# EAGLE design teiler10e7V3 (EAGLE 7.7.0)
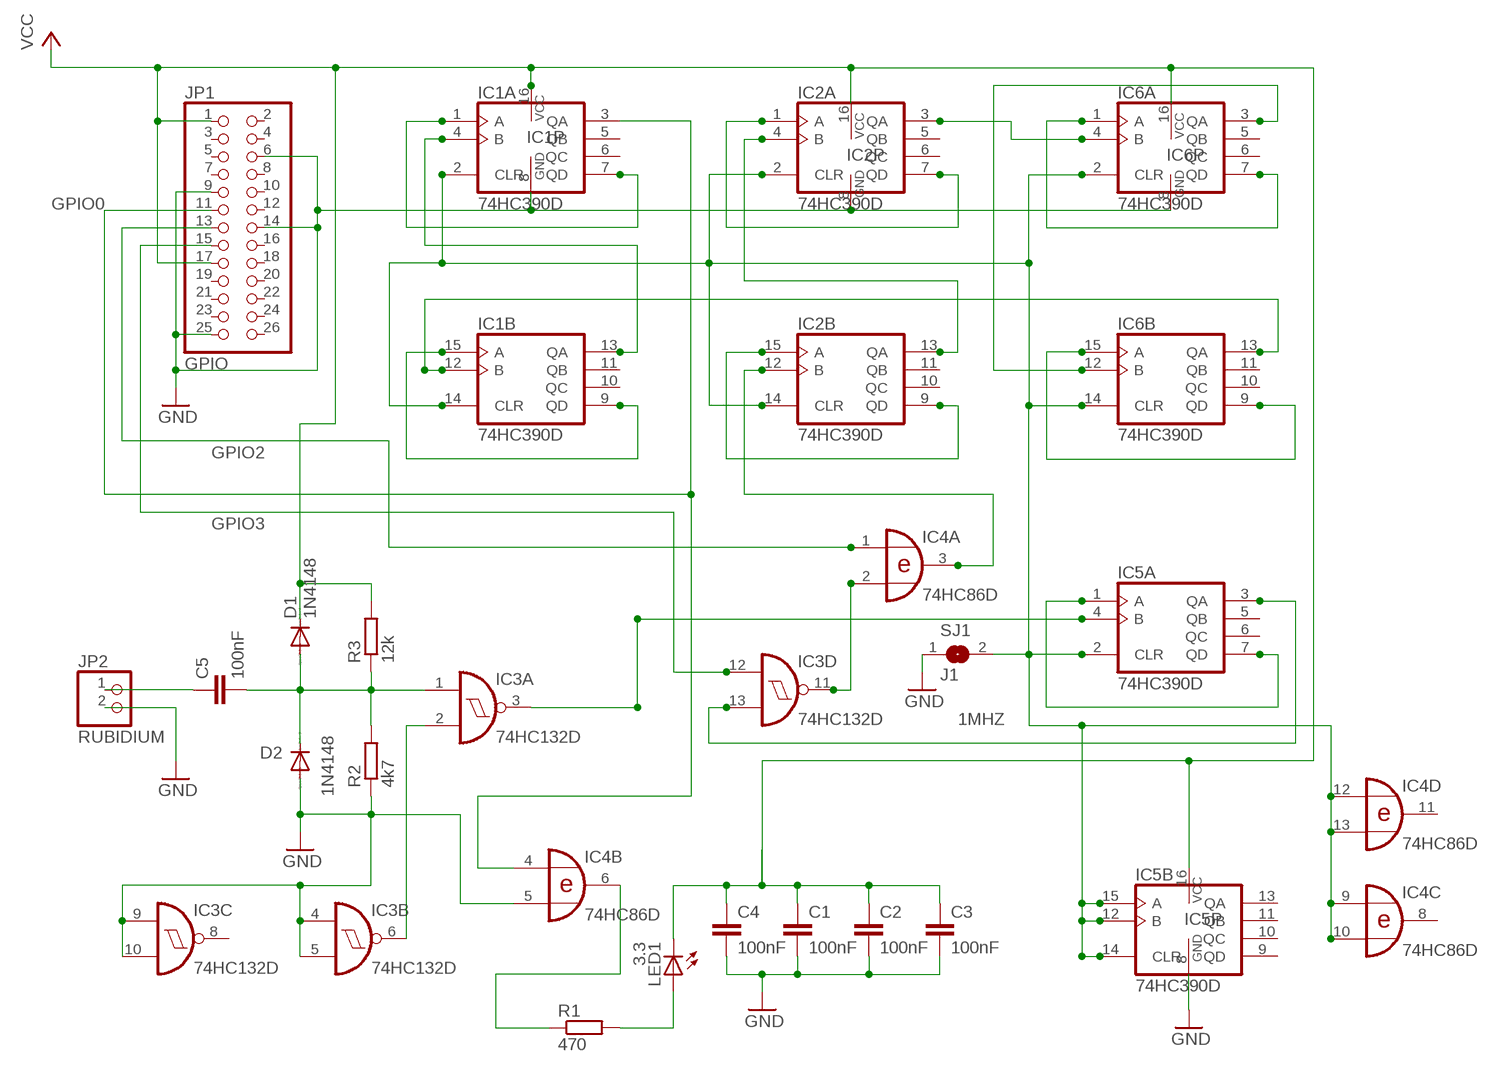
[diagram p0: schematic, sheet 1]

## Parts
C1  100nF  C-EU025-025X050  [C025-025X050]
C2  100nF  C-EU025-025X050  [C025-025X050]
C3  100nF  C-EU025-025X050  [C025-025X050]
C4  100nF  C-EU025-025X050  [C025-025X050]
C5  100nF  C-EU025-025X050  [C025-025X050]
D1  1N4148  1N4148DO35-7  [DO35-7]
D2  1N4148  1N4148DO35-7  [DO35-7]
IC1  74HC390D  [SO16]
IC2  74HC390D  [SO16]
IC3  74HC132D  [SO14]
IC4  74HC86D  [SO14]
IC5  74HC390D  [SO16]
IC6  74HC390D  [SO16]
JP1  GPIO  PINHD-2X13  [2X13]
JP2  RUBIDIUM  PINHD-1X2/90  [1X02/90]
LED1  3.3  LED3MM  [LED3MM]
R1  470  R-EU_0207/10  [0207/10]
R2  4k7  R-EU_0207/10  [0207/10]
R3  12k  R-EU_0207/10  [0207/10]
SJ1  J1  SJW  [SJW]

## Nets
1KHZ: IC6.3(A:QA) IC6.12(B:B)
1MHZ: IC3.13(D:I1) IC5.3(A:QA)
10KHZ: IC2.3(A:QA) IC6.4(A:B)
100KHZ: IC2.4(A:B) IC2.13(B:QA)
CLR: IC1.2(A:CLR) IC1.14(B:CLR) IC2.2(A:CLR) IC2.14(B:CLR) IC4.9(C:I0) IC4.10(C:I1) IC4.12(D:I0) IC4.13(D:I1) IC5.2(A:CLR) IC5.12(B:B) IC5.14(B:CLR) IC5.15(B:A) IC6.2(A:CLR) IC6.14(B:CLR) SJ1.2
GND: C1.2 C2.2 C3.2 C4.2 D2.A IC1.8(P:GND) IC2.8(P:GND) IC3.4(B:I0) IC3.5(B:I1) IC3.9(C:I0) IC3.10(C:I1) IC4.5(B:I1) IC5.8(P:GND) IC6.8(P:GND) JP1.6 JP1.9 JP1.14 JP1.25 JP2.2 R2.1 SJ1.1
GPIO0: IC1.3(A:QA) IC4.4(B:I0) JP1.11
GPIO2: IC4.1(A:I0) JP1.13
GPIO3: IC3.12(D:I0) JP1.15
N$1: IC1.1(A:A) IC1.7(A:QD)
N$2: IC2.1(A:A) IC2.7(A:QD)
N$3: IC1.9(B:QD) IC1.15(B:A)
N$4: IC2.9(B:QD) IC2.15(B:A)
N$5: IC5.1(A:A) IC5.7(A:QD)
N$6: IC1.12(B:B) IC6.13(B:QA)
N$7: IC2.12(B:B) IC4.3(A:O)
N$9: IC1.4(A:B) IC1.13(B:QA)
N$11: C5.1 JP2.1
N$12: IC4.6(B:O) R1.1
N$13: IC3.11(D:O) IC4.2(A:I1)
N$14: IC6.1(A:A) IC6.7(A:QD)
N$15: IC6.9(B:QD) IC6.15(B:A)
N$17: IC3.2(A:I1) IC3.6(B:O)
N$19: IC3.3(A:O) IC5.4(A:B)
N$21: LED1.A R1.2
RUBIDIUM: C5.2 D1.A D2.C IC3.1(A:I0) R2.2 R3.1
VCC: C1.1 C2.1 C3.1 C4.1 D1.C IC1.16(P:VCC) IC2.16(P:VCC) IC5.16(P:VCC) IC6.16(P:VCC) JP1.1 JP1.17 LED1.K(C) R3.2
Unconnected: IC1.5(A:QB) IC1.6(A:QC) IC1.10(B:QC) IC1.11(B:QB) IC2.5(A:QB) IC2.6(A:QC) IC2.10(B:QC) IC2.11(B:QB) IC3.8(C:O) IC4.8(C:O) IC4.11(D:O) IC5.5(A:QB) IC5.6(A:QC) IC5.9(B:QD) IC5.10(B:QC) IC5.11(B:QB) IC5.13(B:QA) IC6.5(A:QB) IC6.6(A:QC) IC6.10(B:QC) IC6.11(B:QB) JP1.2 JP1.3 JP1.4 JP1.5 JP1.7 JP1.8 JP1.10 JP1.12 JP1.16 JP1.18 JP1.19 JP1.20 JP1.21 JP1.22 JP1.23 JP1.24 JP1.26

## Power pins joined to a net without a drawn wire
GND: IC3.7(P:GND) IC4.7(P:GND)
VCC: IC3.14(P:VCC) IC4.14(P:VCC)

## Library data of the parts
C1-C5 = rcl:C-EU: CAPACITOR, European symbol
D1 D2 = diode:1N4148: DIODE high speed (Philips)
IC1 IC2 IC5 IC6 = 74xx-eu:74*390: Dual 4-bit decade and binary COUNTER
IC3 = 74xx-eu:74*132: Quad 2-input NAND schmitt trigger
IC4 = 74xx-eu:74*86: Quad 2-input EXCLUSIVE-OR (XOR) gate
JP1 = pinhead:PINHD-2X13: PIN HEADER
JP2 = pinhead:PINHD-1X2: PIN HEADER
LED1 = led:LED: LED OSRAM: - CHIPLED LG R971, LG N971, LY N971, LG Q971, LY Q971, LO R971, LY R971 LH N974, LH R974 LS Q976, LO Q976, LY Q976 LO Q996 - Hyper CHIPLED LW Q18S LB Q993, LB Q99A, LB R99A - SideLED LS A670, LO A670, LY A670, LG A670, LP A670 LB A673, LV A673, LT A673, LW A673 LH A674 LY A675 LS A676, LA A676, LO A676, LY A676, LW A676 LS A679, LY A679, LG A679 - Hyper Micro SIDELED® LS Y876, LA Y876, LO Y876, LY Y876 LT Y87S - SmartLED LW L88C, LW L88S LB L89C, LB L89S, LG L890 LS L89K, LO L89K, LY L89K LS L896, LA L896, LO L896, LY L896 - TOPLED LS T670, LO T670, LY T670, LG T670, LP T670 LSG T670, LSP T670, LSY T670, LOP T670, LYG T670 LG T671, LOG T671, LSG T671 LB T673, LV T673, LT T673, LW T673 LH T674 LS T676, LA T676, LO T676, LY T676, LB T676, LH T676, LSB T676, LW T676 LB T67C, LV T67C, LT T67C, LS T67K, LO T67K, LY T67K, LW E67C LS E67B, LA E67B, LO E67B, LY E67B, LB E67C, LV E67C, LT E67C LW T67C LS T679, LY T679, LG T679 LS T770, LO T770, LY T770, LG T770, LP T770 LB T773, LV T773, LT T773, LW T773 LH T774 LS E675, LA E675, LY E675, LS T675 LS T776, LA T776, LO T776, LY T776, LB T776 LHGB T686 LT T68C, LB T68C - Hyper Mini TOPLED® LB M676 - Mini TOPLED Santana® LG M470 LS M47K, LO M47K, LY M47K Source: http://www.osram.convergy.de LUXEON: - LUMILED® LXK2-PW12-R00, LXK2-PW12-S00, LXK2-PW14-U00, LXK2-PW14-V00 LXK2-PM12-R00, LXK2-PM12-S00, LXK2-PM14-U00 LXK2-PE12-Q00, LXK2-PE12-R00, LXK2-PE12-S00, LXK2-PE14-T00, LXK2-PE14-U00 LXK2-PB12-K00, LXK2-PB12-L00, LXK2-PB12-M00, LXK2-PB14-N00, LXK2-PB14-P00, LXK2-PB14-Q00 LXK2-PR12-L00, LXK2-PR12-M00, LXK2-PR14-Q00, LXK2-PR14-R00 LXK2-PD12-Q00, LXK2-PD12-R00, LXK2-PD12-S00 LXK2-PH12-R00, LXK2-PH12-S00 LXK2-PL12-P00, LXK2-PL12-Q00, LXK2-PL12-R00 Source: www.luxeon.com KINGBRIGHT: KA-3528ASYC Source: www.kingbright.com
R1-R3 = rcl:R-EU_: RESISTOR, European symbol
SJ1 = jumper:SJ: SMD solder JUMPER

## Net classes
0 default: clearance 0.205 mm

## Board
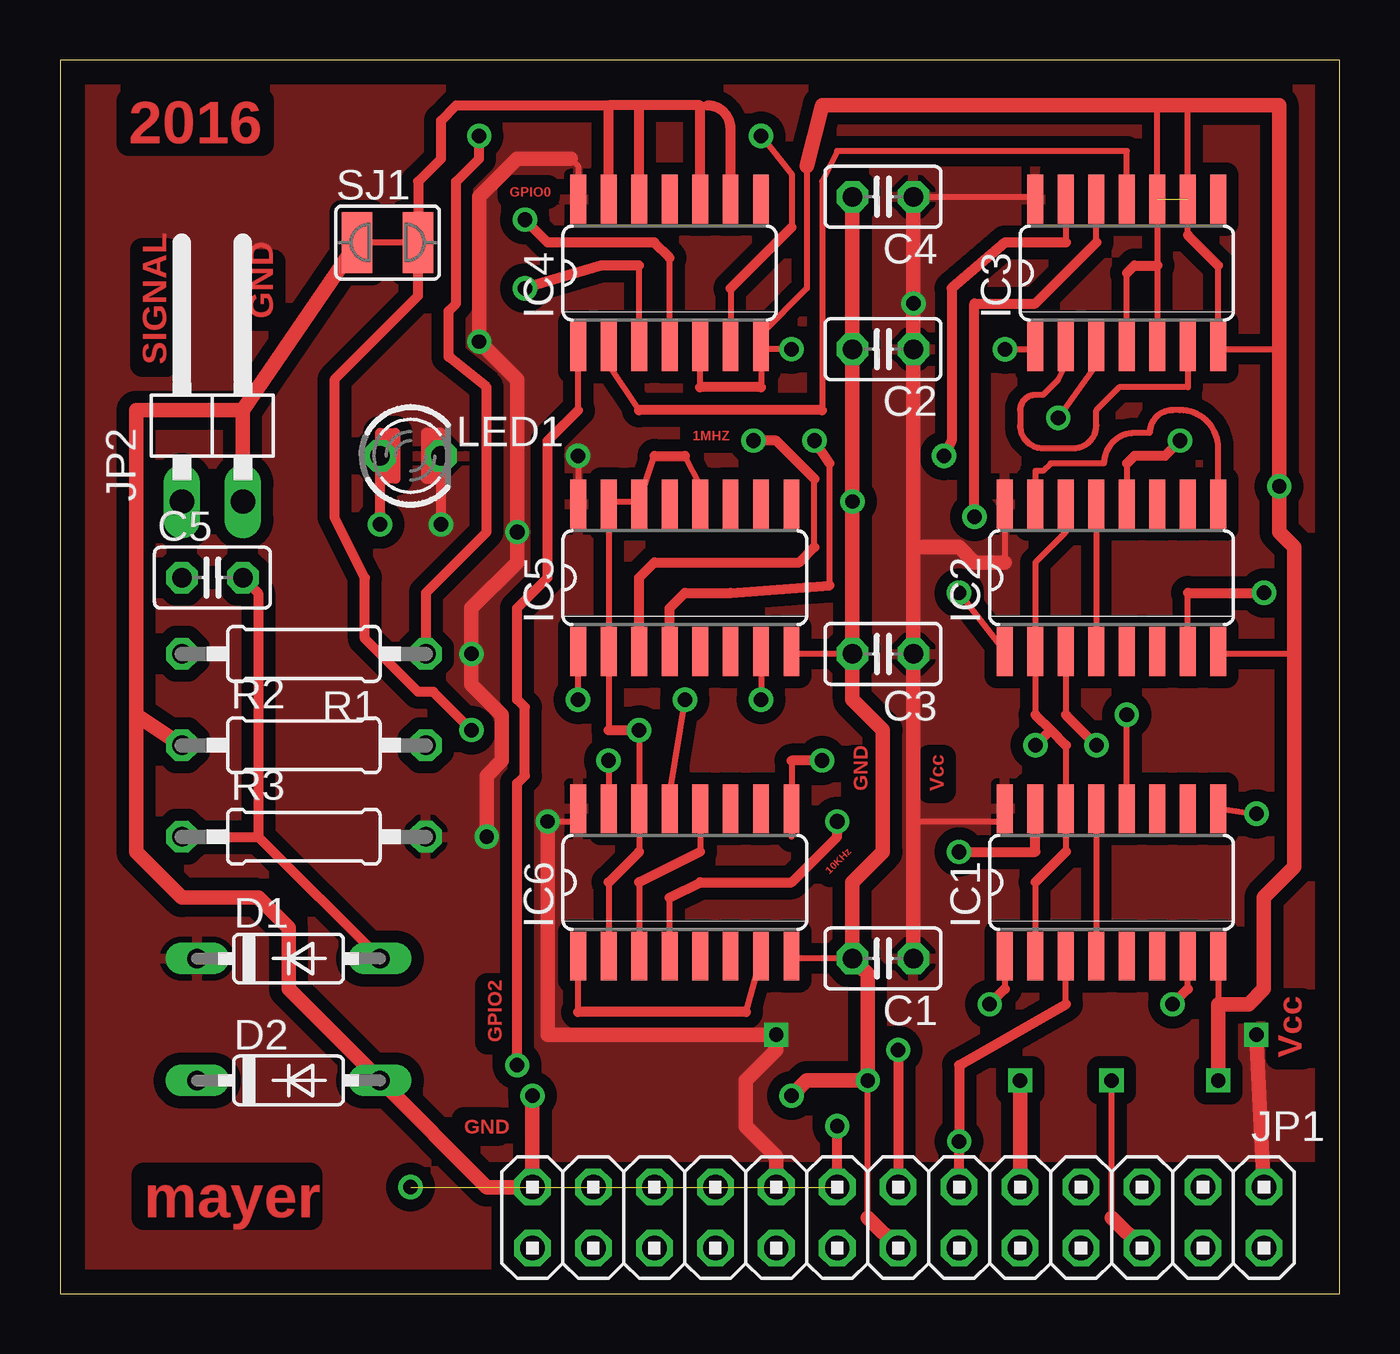
[diagram p1: board, top side]
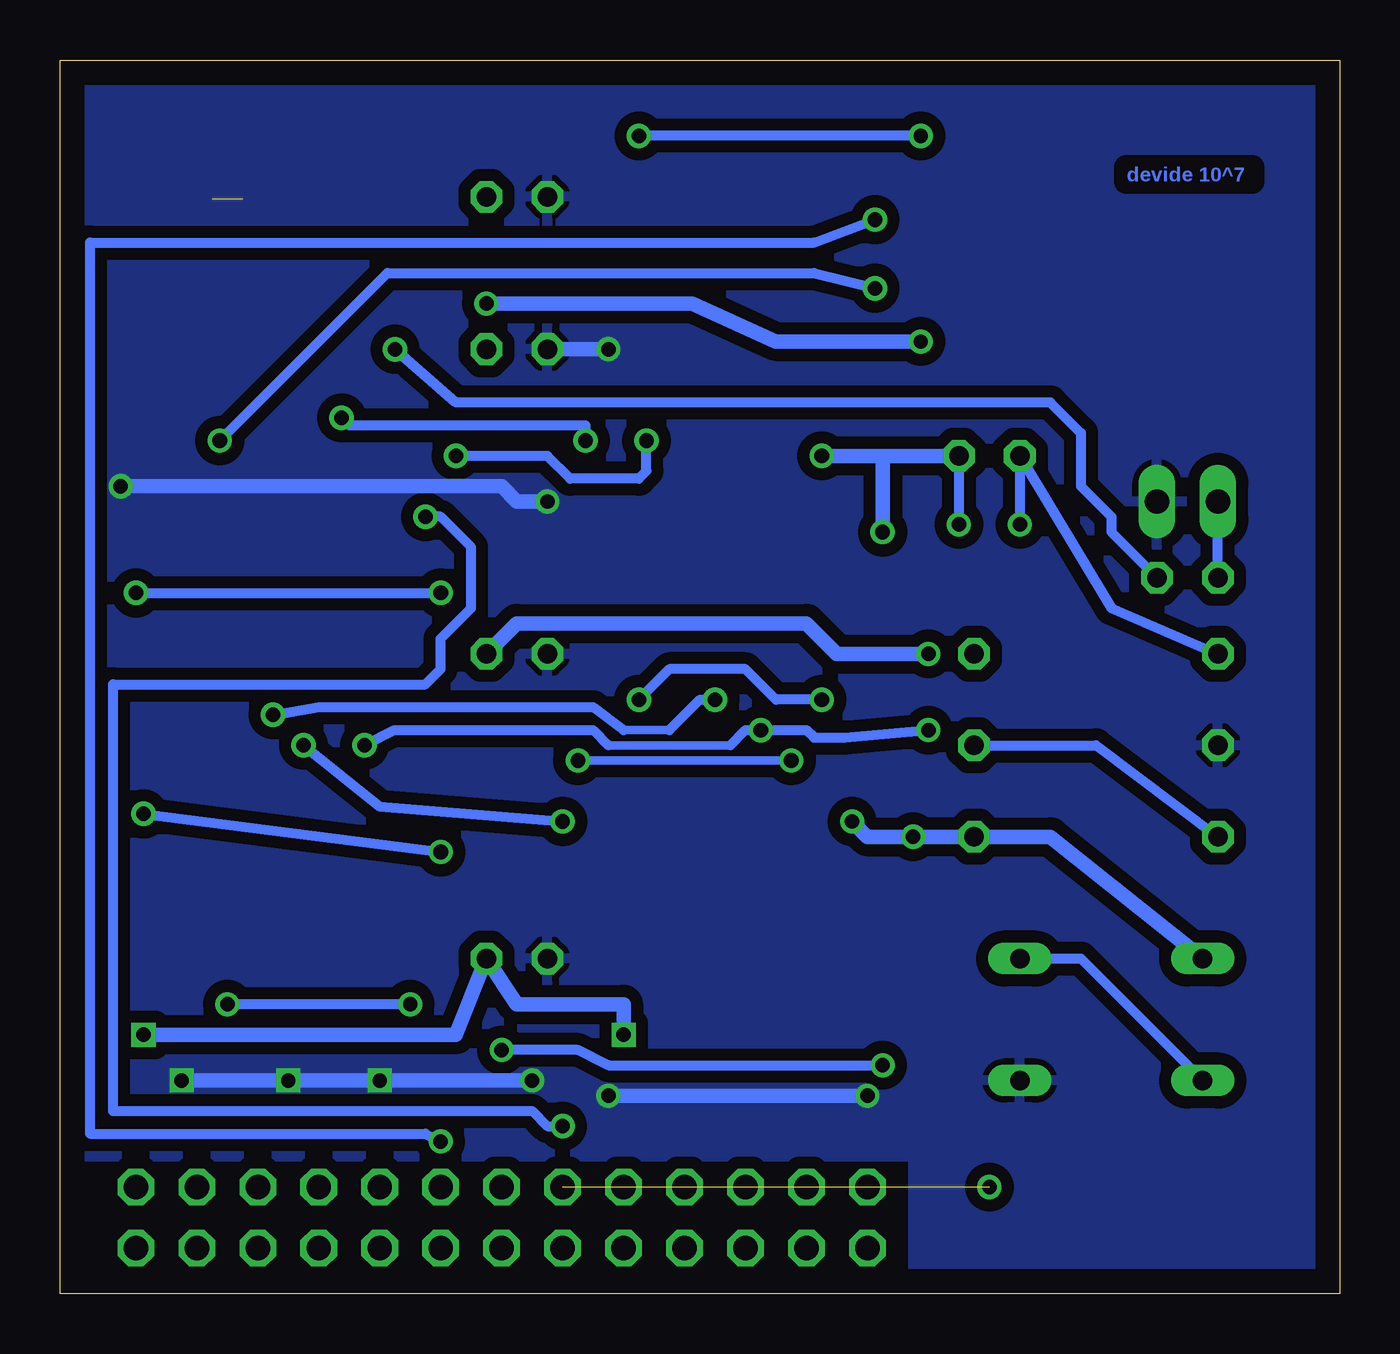
[diagram p2: board, bottom side, seen from below]

Size 53.33 x 51.43 mm. Coordinates in mm from the lower left corner, seen from the top.
Outline: 0,0 53.33,0 53.33,51.43 0,51.43 0,0
Copper layers (1*16): Top 0.035mm / dielectric 1.5mm / Bottom 0.035mm
Design rules "my_drc_defaults *": minimum track width 10mil, minimum drill 0.599440625mm, track to track 10mil, track to pad 10mil, pad to pad 10mil, via to via 10mil, smd to smd 10mil, copper to edge 40mil, drill to drill 8mil, minimum pad ring 10mil, minimum via ring 8mil, stop-mask expansion 4mil, vias tented up to drill 0mil, thermal gap 10mil

### Footprints (pad centres in the part's own frame; a part is rotated, then mirrored left to right if it is on the bottom)
C025-025X050 = drill 0.813 octagon: 1 -1.27,0; 2 1.27,0
DO35-7 = drill 0.813 long: A 3.81,0; C -3.81,0
SO16 = smd 0.66 x 2.032: 1 -4.445,-3.073; 2 -3.175,-3.073; 3 -1.905,-3.073; 4 -0.635,-3.073; 5 0.635,-3.073; 6 1.905,-3.073; 7 3.175,-3.073; 8 4.445,-3.073; 9 4.445,3.073; 10 3.175,3.073; 11 1.905,3.073; 12 0.635,3.073; 13 -0.635,3.073; 14 -1.905,3.073; 15 -3.175,3.073; 16 -4.445,3.073
SO14 = smd 0.66 x 2.032: 1 -3.81,-3.073; 2 -2.54,-3.073; 3 -1.27,-3.073; 4 0,-3.073; 5 1.27,-3.073; 6 2.54,-3.073; 7 3.81,-3.073; 8 3.81,3.073; 9 2.54,3.073; 10 1.27,3.073; 11 0,3.073; 12 -1.27,3.073; 13 -2.54,3.073; 14 -3.81,3.073
2X13 = drill 1.016 octagon: 1 -15.24,-1.27; 2 -15.24,1.27; 3 -12.7,-1.27; 4 -12.7,1.27; 5 -10.16,-1.27; 6 -10.16,1.27; 7 -7.62,-1.27; 8 -7.62,1.27; 9 -5.08,-1.27; 10 -5.08,1.27; 11 -2.54,-1.27; 12 -2.54,1.27; 13 0,-1.27; 14 0,1.27; 15 2.54,-1.27; 16 2.54,1.27; 17 5.08,-1.27; 18 5.08,1.27; 19 7.62,-1.27; 20 7.62,1.27; 21 10.16,-1.27; 22 10.16,1.27; 23 12.7,-1.27; 24 12.7,1.27; 25 15.24,-1.27; 26 15.24,1.27
1X02/90 = drill 1.016 long: 1 -1.27,-3.81; 2 1.27,-3.81
LED3MM = drill 0.813 octagon: A -1.27,0; K 1.27,0
0207/10 = drill 0.813 octagon: 1 -5.08,0; 2 5.08,0
SJW = smd 1.27 x 2.54: 1 -1.27,0; 2 1.27,0

### Placement (x,y rotation side)
C1  34.29,13.97 180 top
C2  34.29,39.37 180 top
C3  34.29,26.67 180 top
C4  34.29,45.72 180 top
C5  6.35,29.84 0 top
D1  9.52,13.97 0 top
D2  9.52,8.89 0 top
IC1  43.81,17.14 0 top
IC2  43.81,29.84 0 top
IC3  44.45,42.55 0 top
IC4  25.4,42.55 0 top
IC5  26.03,29.84 0 top
IC6  26.03,17.14 0 top
JP1  34.92,3.17 180 top
JP2  6.35,36.83 0 top
LED1  14.61,34.93 0 top
R1  10.16,26.67 180 top
R2  10.16,22.86 0 top
R3  10.16,19.05 0 top
SJ1  13.65,43.82 0 top

### Tracks (layer width: path | path; a pad name or v marks a point on that pad's centre or on a via)
1KHZ
  Top 0.254: 24.13,17.14 IC6.3 | IC6.12 26.67,18.41
  Top 0.406: 26.67,18.41 24.13,17.14
1MHZ  (via drill 0.61)
  Top 0.254: IC3.13 41.91,43.82 | 31.43,31.11 31.43,33.97
  Top 0.406: v36.83,34.93 37.15,35.56 37.15,41.91 39.37,43.82 41.91,43.82 | IC5.3 24.13,29.84 24.77,30.48 30.8,30.48 31.43,31.11 | 31.43,33.97 29.84,35.56 v28.89,35.56
  Bottom 0.406: v28.89,35.56 28.89,34.29 29.21,33.97 32.07,33.97 33.02,34.93 v36.83,34.93
10KHZ  (via drill 0.61)
  Top 0.254: IC2.3 41.91,24.13 | IC6.4 25.4,16.51
  Top 0.406: 41.91,24.13 v43.18,22.86 | 25.4,16.51 26.67,17.14 30.48,17.14 32.38,19.05 v32.38,19.68
  Bottom 0.406: v43.18,22.86 40.01,20.32 v32.38,19.68
100KHZ
  Top 0.254: IC2.13 IC2.4
CLR  (via drill 0.6, 0.61)
  Top 0.254: 40.64,17.14 IC1.2 | 41.91,18.41 IC1.14 41.91,22.86 | IC2.14 41.91,31.75 40.64,30.48 IC2.2 40.64,24.13 | 22.86,17.14 IC6.2 | 24.13,18.41 IC6.14 v24.13,23.49 | 22.86,45.72 IC4.13 | 24.13,33.02 22.86,33.02 IC5.15 IC5.2 22.86,23.49 | IC5.12 26.67,33.66 26.03,34.93 | 24.13,33.02 24.77,34.93 | 24.13,33.02 IC5.14 | 26.99,49.53 26.67,49.53
  Top 0.406: 41.91,18.41 40.64,17.14 | 40.64,24.13 41.27,23.49 | 41.27,23.49 41.91,22.86 | 24.13,18.41 22.86,17.14 | 24.77,34.93 26.03,34.93 | 22.86,23.49 v24.13,23.49 | v40.64,22.86 41.27,23.49 | IC4.13 22.86,49.53 | IC4.10 26.67,49.53 24.13,49.53 | 24.13,49.53 22.86,49.53 | IC4.12 24.13,49.53 | IC4.9 27.94,48.58 arc90 26.99,49.53 | v17.14,23.49 15.56,25.08 14.92,25.08 12.7,27.3 12.7,29.84 11.43,32.39 11.43,38.1 14.92,41.59 SJ1.2 14.92,46.36 15.88,47.31 15.88,48.9 16.51,49.53 22.86,49.53
  Bottom 0.356: 30.48,22.86 25.4,22.86
  Bottom 0.406: v17.14,23.49 20.64,23.18 21.91,23.18 22.23,23.49 v24.13,23.49 24.77,23.49 25.4,22.86 | v40.64,22.86 39.37,23.49 31.12,23.49 30.48,22.86
GND  (via drill 0.6)  (1 unrouted)
  Top 0.254: 43.81,3.17 v43.81,8.89 | 33.66,3.17 v33.66,8.89 | 26.67,37.78 IC4.5 | 29.21,39.37 IC4.7 29.21,40.01 31.12,41.91 31.12,46.99 | 29.21,39.37 29.21,37.78 | 44.45,39.37 IC3.4 44.45,42.55 | 45.72,39.37 IC3.5 45.72,42.86 IC3.10 45.72,49.53 | 46.99,45.72 IC3.9 | C3.2 30.48,26.67 IC5.8 | C1.2 30.48,13.97 IC6.8 | 51.43,26.67 48.26,26.67 IC2.8 | 48.26,14.61 IC1.8 48.26,12.06 | v30.48,39.37 29.21,39.37 | 50.8,39.37 48.26,39.37 IC3.7 48.26,42.86 | 46.99,44.13 46.99,49.53
  Top 0.406: 29.21,37.78 26.67,37.78 | 48.26,42.86 46.99,44.13 | 44.45,42.55 44.77,42.86 45.72,42.86
  Top 0.61: v40.01,8.89 JP1.9 | JP1.6 43.81,3.17 | JP1.14 33.66,3.17 | 7.62,36.83 SJ1.1 | JP2.2 7.62,36.83 | 3.18,24.13 R2.1 | 3.18,24.13 3.18,18.41 5.08,16.51 8.25,16.51 9.52,15.24 9.52,12.7 D2.A 17.78,4.45 JP1.25 v19.69,8.26 | 7.62,36.83 3.18,36.83 3.18,24.13 | 31.12,46.99 31.75,49.53 45.72,49.53 46.99,49.53 50.8,49.53 50.8,39.37 v50.8,33.66 50.8,31.75 51.43,31.11 51.43,26.67 51.43,17.78 50.16,16.51 50.16,12.7 49.53,12.06 48.26,12.06 v48.26,8.89 | C4.2 C2.2 v33.02,33.02 C3.2 33.02,24.76 34.29,23.49 34.29,18.41 33.02,17.14 C1.2 33.66,13.34 v33.66,8.89 31.12,8.89 v30.48,8.26
  Bottom 0.61: v48.26,8.89 v43.81,8.89 v40.01,8.89 v33.66,8.89 | v19.69,8.26 v30.48,8.26 | C2.2 v30.48,39.37 | v33.02,33.02 34.29,33.02 34.92,33.66 v50.8,33.66
  pour Bottom (isolate 0.508): 0.63,0.64 17.78,0.64 17.78,5.71 52.71,5.71 52.71,46.99 52.71,50.8 0.63,50.8 0.63,20.95
GPIO0  (via drill 0.6, 0.61)
  Top 0.254: 41.91,12.06 IC1.3 | IC4.4 25.4,43.18
  Top 0.406: 41.91,12.06 37.46,9.53 v37.46,6.35 JP1.11 | 25.4,43.18 24.77,43.82 20.32,43.82 v19.37,44.77
  Bottom 0.406: v37.46,6.35 38.1,6.67 52.07,6.67 52.07,43.82 21.91,43.82 v19.37,44.77
GPIO2  (via drill 0.6)
  Top 0.254: 21.59,36.83 IC4.1
  Top 0.406: v34.92,10.16 JP1.13 | v19.05,9.53 19.05,21.27 19.37,21.59 19.37,24.45 19.05,24.76 19.05,28.57 20.32,29.84 20.32,35.56 21.59,36.83
  Bottom 0.406: v19.05,9.53 30.48,9.53 31.75,10.16 v34.92,10.16
GPIO3  (via drill 0.6, 0.61)  (1 unrouted)
  Top 0.254: 43.18,43.82 IC3.12
  Top 0.406: 43.18,43.82 40.64,41.27 38.1,41.27 v38.1,32.39 | JP1.15 v32.38,6.99
  Bottom 0.406: v38.1,32.39 37.46,32.39 36.2,31.11 36.2,28.57 37.46,27.3 37.46,26.04 38.1,25.4 51.12,25.4 51.12,7.62 33.66,7.62 33.02,6.99 v32.38,6.99
  other vias: 14.61,4.45
N$1  (via drill 0.6)
  Top 0.254: IC1.1 39.37,12.7 | 46.99,12.7 IC1.7
  Top 0.406: 39.37,12.7 v38.73,12.06 | v46.35,12.06 46.99,12.7
  Bottom 0.406: v38.73,12.06 v46.35,12.06
N$2  (via drill 0.61)
  Top 0.254: v37.46,29.21 IC2.1 | IC2.7 46.99,29.21
  Top 0.406: 46.99,29.21 v50.16,29.21
  Bottom 0.406: v50.16,29.21 v37.46,29.21
N$3  (via drill 0.61)
  Top 0.254: IC1.9 v49.85,20
  Top 0.406: v37.46,18.41 40.64,18.41 IC1.15
  Bottom 0.406: v49.85,20 v37.46,18.41
N$4
  Top 0.254: IC2.15 40.64,34.29 40.96,34.29 41.27,34.61 43.5,34.61 arc-90 44.77,35.88 45.4,35.88 arc-90 46.35,36.83 46.67,36.83 arc-90 48.26,35.24 IC2.9
N$5  (via drill 0.61)
  Top 0.254: v21.59,24.76 IC5.1 | IC5.7 v29.21,24.76
  Bottom 0.406: v21.59,24.76 23.49,24.76 24.77,26.04 27.94,26.04 v29.21,24.76
N$6  (via drill 0.61)
  Top 0.254: IC6.13 25.4,20.95 v26.03,24.76 | IC1.12 v44.45,24.13
  Bottom 0.356: 29.84,23.49 27.94,23.49
  Bottom 0.406: v44.45,24.13 42.55,24.45 31.12,24.45 29.84,23.49 | 27.94,23.49 26.67,24.76 v26.03,24.76
N$7  (via drill 0.61)
  Top 0.254: IC4.3 24.13,42.86 | 44.45,34.61 IC2.12
  Top 0.406: 24.13,42.86 22.54,42.86 v19.37,41.91 | v46.67,35.56 46.04,34.93 44.77,34.93 44.45,34.61
  Bottom 0.406: v19.37,41.91 21.91,42.55 39.69,42.55 v46.67,35.56
N$8
  pour Bottom (isolate 0.508): 1.9,5.71 52.71,5.71 52.71,50.8 1.9,50.8
N$9
  Top 0.254: IC1.13 IC1.4
N$10
  pour Top (isolate 0.508): 1.9,5.71 52.71,5.71 52.71,50.8 1.9,50.8
N$11
  Bottom 0.406: C5.1 JP2.1
N$12  (via drill 0.6)
  Top 0.254: 27.94,41.91 IC4.6 | 30.48,44.45 30.48,46.67 v29.21,48.26
  Top 0.406: 30.48,44.45 27.94,41.91 | v17.46,48.26 17.46,47.31 16.51,46.36 16.51,41.27 16.19,40.96 16.19,39.05 17.78,37.78 17.78,31.75 15.24,29.21 R1.1
  Bottom 0.406: v17.46,48.26 v29.21,48.26
N$13
  Top 0.254: IC4.2 22.86,38.73 24.13,36.83 | 31.75,36.83 31.75,46.36 32.38,47.62 44.45,47.62 IC3.11
  Top 0.406: 31.75,36.83 24.13,36.83
N$14
  Top 0.254: 21.59,11.75 IC6.1 | IC6.7 28.57,11.75
  Top 0.406: 28.57,11.75 21.59,11.75
N$15  (via drill 0.61)
  Top 0.254: v22.86,22.22 IC6.15 | 30.48,19.05 IC6.9 30.48,22.22
  Top 0.406: v31.75,22.22 30.48,22.22
  Bottom 0.356: v31.75,22.22 v22.86,22.22
N$17
  Top 0.254: IC3.2 41.91,38.73 41.59,38.1 40.96,37.47 40.64,37.47 arc90 40.01,36.83 40.01,36.2 arc90 40.96,35.24 42.23,35.24 arc90 43.18,36.2 43.18,36.83 44.13,37.78 46.99,37.78 IC3.6
N$19  (via drill 0.61)
  Top 0.254: v41.59,36.51 43.18,38.73 IC3.3 | 32.07,29.53 32.07,34.61
  Top 0.406: IC5.4 25.4,28.57 26.03,29.21 27.94,29.21 32.07,29.53 | 32.07,34.61 v31.43,35.56
  Bottom 0.406: v31.43,35.56 31.43,36.2 41.27,36.2 v41.59,36.51
N$21  (via drill 0.6)
  Top 0.406: v13.34,32.07 13.34,33.97 | 13.65,35.88 13.34,35.88 LED1.A 13.34,33.97 | 13.65,35.88 13.97,35.88 13.97,33.97 13.65,33.97 | 13.65,33.97 13.34,33.97 | 13.65,35.88 13.65,33.97
  Bottom 0.406: R1.2 9.52,28.57 LED1.A v13.34,32.07
N$22
  Top 0.254: 14.61,43.82 12.7,43.82
RUBIDIUM  (via drill 0.61)
  Top 0.254: v39.37,39.37 40.64,39.37 IC3.1
  Top 0.406: 8.25,19.05 D1.A | R3.1 8.25,19.05 | C5.2 8.25,29.21 8.25,19.05
  Bottom 0.406: D2.C 10.79,13.97 D1.A | R3.1 10.16,22.86 R2.2 | v39.37,39.37 36.83,37.15 12.06,37.15 10.79,35.88 10.79,33.66 9.52,32.39 9.52,31.75 C5.2
VCC  (via drill 0.6, 0.61)
  Top 0.254: v21.59,34.93 IC5.16 | 21.59,45.09 IC4.14 21.59,46.99 21.27,47.31 | v20.32,19.68 21.59,19.68 IC6.16 | C4.1 40.64,45.72 IC3.14 | 35.56,19.68 39.37,19.68 IC1.16 | IC2.16 39.37,30.48
  Top 0.406: v15.88,32.07 15.88,33.97 | 15.56,35.88 15.88,35.88 LED1.K 15.88,33.97 | 15.56,35.88 15.24,35.88 15.24,33.97 15.56,33.97 | 15.56,33.97 15.88,33.97 | 15.56,35.88 15.56,33.97
  Top 0.61: JP1.1 v49.85,10.79 | C4.1 v35.56,41.27 C2.1 35.56,31.11 | C1.1 35.56,19.68 C3.1 35.56,31.11 | v20.32,19.68 20.32,10.79 v29.84,10.79 29.84,10.16 28.57,8.89 28.57,6.99 29.84,5.71 JP1.17 | 39.37,30.48 38.1,30.48 37.46,31.11 35.56,31.11 | v17.78,19.05 17.78,21.59 18.41,22.22 18.41,24.13 17.14,25.4 v17.14,26.67 17.14,28.57 19.05,30.48 v19.05,31.75 19.05,38.1 v17.46,39.69 17.46,45.72 19.05,47.31 21.27,47.31
  Bottom 0.406: LED1.K v15.88,32.07
  Bottom 0.61: 5.08,13.97 D1.C 12.06,19.05 R3.2 v17.78,19.05 19.69,19.05 v20.32,19.68 | LED1.K 19.05,34.93 | 19.05,34.93 v21.59,34.93 | 19.05,34.93 v19.05,31.75 | v29.84,10.79 29.84,12.06 34.29,12.06 C1.1 36.83,10.79 v49.85,10.79 | v35.56,41.27 26.99,41.27 23.49,39.69 v17.46,39.69 | C3.1 34.29,27.94 22.23,27.94 20.95,26.67 v17.14,26.67
  pour Top (isolate 0.508): 0.63,0.64 17.78,0.64 17.78,5.71 52.71,5.71 52.71,50.8 0.63,50.8

### Text on the board
Top: 2016 | GPIO0 | GND | SIGNAL | 1MHZ | GND | Vcc | 10KHz | GPIO2 | Vcc | GND | mayer
Bottom: devide 10^7